# Altium schematic sheet AtlasControl-A1.01.01F.SchDoc: ATLAS-CONTROL-A1
size A3; Revision: 01; SheetNumber: 2; SheetTotal: 7
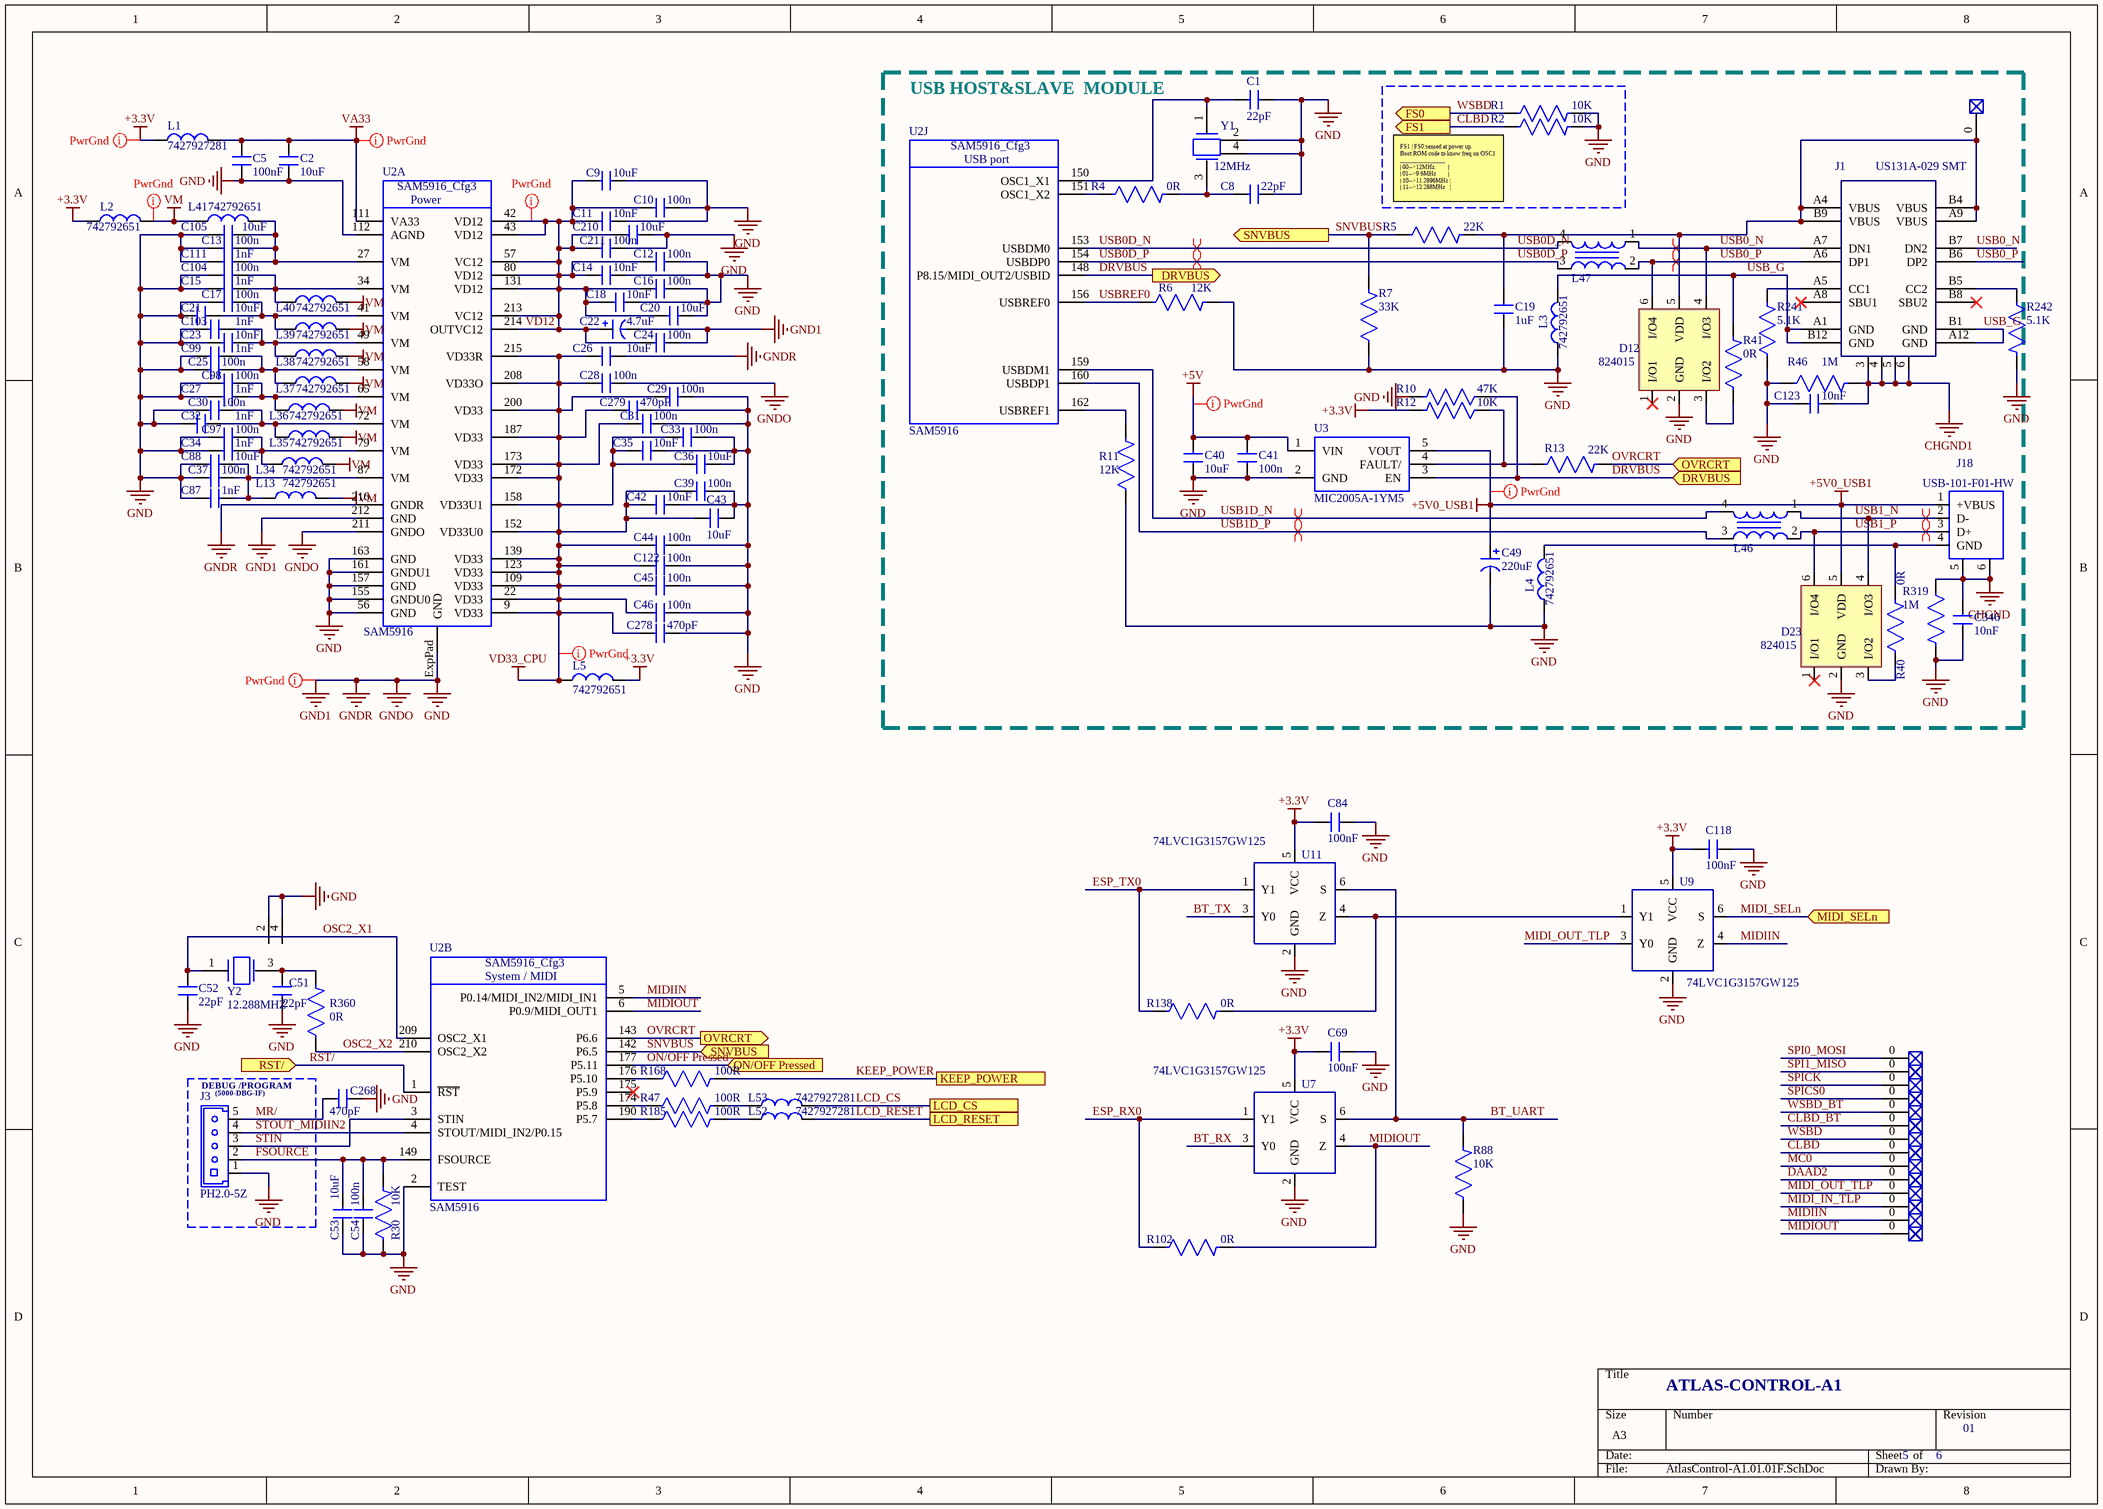
[diagram p0: AtlasControl-A1.01.01F.SchDoc]

## Parts
+5V2  CON/TestPoints  [TP]  (value not drawn)  (no BOM)
C1  22pF  [0402]
C2  10uF  [0402]
C5  100nF  [0402]
C8  22pF  [0402]
C9  10uF  [0603]
C10  100n  [0603]
C11  10nF  [0603]
C12  100n  [0603]
C13  100n  [0603]
C14  10nF  [0603]
C15  1nF  [0603]
C16  100n  [0603]
C17  100n  [0603]
C18  10nF  [0603]
C19  1uF  [0603]
C20  10uF  [0603]
C21  10uF  [0603]
C22  4.7uF  [CAP_TAN_A_3216]
C23  10nF  [0603]
C24  100n  [0603]
C25  100n  [0603]
C26  10uF  [0603]
C27  1nF  [0603]
C28  100n  [0603]
C29  100n  [0603]
C30  100n  [0603]
C31  100n  [0603]
C32  1nF  [0603]
C33  100n  [0603]
C34  1nF  [0603]
C35  10nF  [0603]
C36  10uF  [0603]
C37  100n  [0603]
C39  100n  [0603]
C40  10uF  [0603]
C41  100n  [0603]
C42  10nF  [0603]
C43  10uF  [0603]
C44  100n  [0603]
C45  100n  [0603]
C46  100n  [0603]
C49  220uF  [VT-6.3*7.7]
C51  22pF  [0402]
C52  22pF  [0402]
C53  10uF  [0603]
C54  100n  [0603]
C69  100nF  [0402]
C84  100nF  [0402]
C87  1nF  [0603]
C88  10uF  [0603]
C97  100n  [0603]
C98  100n  [0603]
C99  1nF  [0603]
C103  1nF  [0603]
C104  100n  [0603]
C105  10uF  [0603]
C111  1nF  [0603]
C118  100nF  [0402]
C122  100n  [0603]
C123  10nF  [0603]
C210  10uF  [0603]
C211  100n  [0603]
C268  470pF  [0603]
C278  470pF  [0603]
C279  470pF  [0603]
C346  10nF  [0603]
CKOUT  CON/TestPoints/DIP  [TP2]  (value not drawn)  (no BOM)
CLBD  CON/TestPoints/DIP  [TP2]  (value not drawn)  (no BOM)
CLBD_BT  CON/TestPoints/DIP  [TP2]  (value not drawn)  (no BOM)
D12  824015  [SOT23-6L]
D23  824015  [SOT23-6L]
DAAD2  CON/TestPoints/DIP  [TP2]  (value not drawn)  (no BOM)
J1  US131A-029 SMT  [US131A-029 SMT]
J3  value PH2.0-5Z  [PH2.0-05Z]  (hidden comment: CON/PH2.0/PH2.0-05Z)
J18  USB-101-F01-HW  [USBZ_UP_DW]
L1  7427927281  [0402]
L2  742792651  [0603]
L3  742792651  [0603]
L4  742792651  [0603]
L5  742792651  [0603]
L13  742792651  [0603]
L34  742792651  [0603]
L35  742792651  [0603]
L36  742792651  [0603]
L37  742792651  [0603]
L38  742792651  [0603]
L39  742792651  [0603]
L40  742792651  [0603]
L41  742792651  [0603]
L46  MCZ1210AH900L2TA0G  [MCZ1210]  (value not drawn)
L47  MCZ1210AH900L2TA0G  [MCZ1210]  (value not drawn)
L52  7427927281  [0402]
L53  7427927281  [0402]
MIDI_IN_TLP  CON/TestPoints/DIP  [TP2]  (value not drawn)  (no BOM)
MIDI_OUT_TLP  CON/TestPoints/DIP  [TP2]  (value not drawn)  (no BOM)
MIDIIN  CON/TestPoints/DIP  [TP2]  (value not drawn)  (no BOM)
MIDIOUT  CON/TestPoints/DIP  [TP2]  (value not drawn)  (no BOM)
R1  10K  [0402]
R2  10K  [0402]
R4  0R  [0402]
R5  22K  [0603]
R6  12K  [0402]
R7  33K  [0603]
R10  47K  [0603]
R11  12K  [0402]
R12  10K  [0402]
R13  22K  [0402]
R30  10K  [0603]
R40  0R  [0603]
R41  0R  [0603]
R46  1M  [0603]
R47  100R  [0402]
R88  10K  [0402]
R102  0R  [0402]
R138  0R  [0402]
R168  100R  [0402]
R185  100R  [0402]
R241  5.1K  [0402]
R242  5.1K  [0402]
R319  1M  [0603]
R360  0R  [0402]
SPI0_MOSI  CON/TestPoints/DIP  [TP2]  (value not drawn)  (no BOM)
SPI1_MISO  CON/TestPoints/DIP  [TP2]  (value not drawn)  (no BOM)
SPICK  CON/TestPoints/DIP  [TP2]  (value not drawn)  (no BOM)
SPICS0  CON/TestPoints/DIP  [TP2]  (value not drawn)  (no BOM)
U2  SAM5916  [LQFP216-26X26]  (parts A,B,J of 10)
U3  MIC2005A-1YM5  [SOT-23-5]
U7  74LVC1G3157GW125  [SOT363]
U9  74LVC1G3157GW125  [SOT363]
U11  74LVC1G3157GW125  [SOT363]
WSBD  CON/TestPoints/DIP  [TP2]  (value not drawn)  (no BOM)
WSBD_BT  CON/TestPoints/DIP  [TP2]  (value not drawn)  (no BOM)
Y1  12MHz  [Seam 3.2*2.5 4PAD-SMD]
Y2  12.288MHZ  [Seam 3.2*2.5 4PAD-SMD]

## Blocks framed on the sheet
USB HOST&SLAVE  MODULE: +5V2 C1 C8 C19 C40 C41 C49 C123 C346 D12 D23 J1 J18 L3 L4 L46 L47 R1 R2 R4-R7 R10-R13 R40 R41 R46 R241 R242 R319 U2 U3 Y1
DEBUG /PROGRAM: J3

## Ports
DRVBUS (in), DRVBUS (out), FS0 (out), FS1 (out), KEEP_POWER, LCD_CS, LCD_RESET, MIDI_SELn (in), ON/OFF Pressed (in), OVRCRT (in), OVRCRT (out), RST/ (in), SNVBUS (in), SNVBUS (out)

## Nets
+3.3V: C69.2 C84.2 C118.2 L1.1 L2.1 L5.2 R12.2 U7.5(VCC) U9.5(VCC) U11.5(VCC)
+5V: C40.1 C41.2 U3.1(VIN)
+5V0_USB1: C49.1 D23.5(VDD) J18.1(+VBUS) U3.5(VOUT)
CHGND: C346.2 J18.5 J18.6 R319.1
CHGND1: C123.1 J1.3 J1.4 J1.5 J1.6 R46.2
GND: C1.2 C2.2 C5.2 C8.2 C9.2 C10.2 C11.2 C12.2 C13.1 C14.2 C15.1 C16.2 C17.1 C18.2 C19.2 C20.2 C21.2 C22.2 C23.1 C24.2 C25.1 C26.2 C27.1 C28.2 C29.2 C30.1 C31.2 C32.2 C33.2 C34.1 C35.2 C36.2 C37.1 C39.2 C40.2 C41.1 C42.2 C43.2 C44.2 C45.2 C46.2 C49.2 C51.2 C52.2 C53.2 C54.1 C69.1 C84.1 C87.1 C88.2 C97.1 C98.1 C99.1 C103.1 C104.1 C105.1 C111.1 C118.1 C122.2 C123.2 C210.2 C211.2 C268.2 C278.2 C279.2 C346.1 D12.2(GND) D23.2(GND) J3.1 L3.1 L4.1 R1.2 R2.2 R6.2 R7.1 R10.2 R11.1 R30.1 R46.1 R88.1 R241.1 R242.2 R319.2 U2.2(TEST) U2.56(GND) U2.112(AGND) U2.155(GNDU0) U2.157(GND) U2.161(GNDU1) U2.163(GND) U2.211(GNDO) U2.212(GND) U2.216(GNDR) U2.ExpPad(GND) U3.2(GND) U7.2(GND) U9.2(GND) U11.2(GND) Y1.2 Y1.4 Y2.2 Y2.4  [also labelled GND1, GNDO, GNDR]
VA33: C2.1 C5.1 L1.2 U2.111(VA33)
VD33_CPU: C26.1 C28.1 C29.1 C31.1 C33.1 C35.1 C36.1 C39.1 C42.1 C43.1 C44.1 C45.1 C46.1 C122.1 C278.1 C279.1 L5.1 U2.9(VD33) U2.22(VD33) U2.109(VD33) U2.123(VD33) U2.139(VD33) U2.152(VD33U0) U2.158(VD33U1) U2.172(VD33) U2.173(VD33) U2.187(VD33) U2.200(VD33) U2.208(VD33O) U2.215(VD33R)
VM: L2.2 L13.2 L34.2 L35.2 L36.2 L37.2 L38.2 L39.2 L40.2 L41.1
BT_RX: U7.3(Y0)
BT_TX: U11.3(Y0)
BT_UART: R88.2 U7.6(S) U11.6(S)
CLBD: CLBD.0 R2.1 ; port FS1
CLBD_BT: CLBD_BT.0
DAAD2: DAAD2.0
DRVBUS: R10.1 U2.148(P8.15/MIDI_OUT2/USBID) U3.3(EN) ; port DRVBUS
ESP_RX0: R102.1 U7.1(Y1)
ESP_TX0: R138.1 U11.1(Y1)
FSOURCE: C53.1 C54.2 J3.2 R30.2 U2.149(FSOURCE)
KEEP_POWER: R168.2 ; port KEEP_POWER
LCD_CS: L53.2 ; port LCD_CS
LCD_RESET: L52.2 ; port LCD_RESET
MC0: CKOUT.0
MIDI_IN_TLP: MIDI_IN_TLP.0
MIDI_OUT_TLP: MIDI_OUT_TLP.0 U9.3(Y0)
MIDI_SELn: U9.6(S) ; port MIDI_SELn
MIDIIN: MIDIIN.0 U2.5(P0.14/MIDI_IN2/MIDI_IN1) U9.4(Z)
MIDIOUT: MIDIOUT.0 R102.2 U2.6(P0.9/MIDI_OUT1) U7.4(Z)
MR/: C268.1 J3.5
ON/OFF Pressed: U2.177(P5.11) ; port ON/OFF Pressed
OSC2_X1: C52.1 U2.209(OSC2_X1) Y2.1
OSC2_X2: R360.1 U2.210(OSC2_X2)
OVRCRT: R13.2 U2.143(P6.6) ; port OVRCRT
RST/: U2.1(~{RST}) ; port RST/
SNVBUS: R5.1 R7.2 U2.142(P6.5) ; port SNVBUS
SPI0_MOSI: SPI0_MOSI.0
SPI1_MISO: SPI1_MISO.0
SPICK: SPICK.0
SPICS0: SPICS0.0
STIN: J3.3 U2.3(STIN)
STOUT_MIDIIN2: J3.4 U2.4(STOUT/MIDI_IN2/P0.15)
USB0_N: D12.4(I/O3) J1.A7(DN1) J1.B7(DN2) L47.1
USB0_P: D12.6(I/O4) J1.A6(DP1) J1.B6(DP2) L47.2
USB0D_N: L47.4 U2.153(USBDM0)
USB0D_P: L47.3 U2.154(USBDP0)
USB1_N: D23.4(I/O3) J18.2(D-) L46.1
USB1_P: D23.6(I/O4) J18.3(D+) L46.2
USB1D_N: L46.4 U2.159(USBDM1)
USB1D_P: L46.3 U2.160(USBDP1)
USB_G: J1.A1(GND) J1.A12(GND) J1.B1(GND) J1.B12(GND) L3.2 R41.2
USBREF0: R6.1 U2.156(USBREF0)
VD12: C9.1 C10.1 C11.1 C12.1 C14.1 C16.1 C18.1 C20.1 C22.1 C24.1 C210.1 C211.1 U2.42(VD12) U2.43(VD12) U2.57(VC12) U2.80(VD12) U2.131(VD12) U2.213(VC12) U2.214(OUTVC12)
WSBD: R1.1 WSBD.0 ; port FS0
WSBD_BT: WSBD_BT.0
Net+5V2_0: +5V2.0 C19.1 D12.5(VDD) J1.A4(VBUS) J1.A9(VBUS) J1.B4(VBUS) J1.B9(VBUS) R5.2
NetC1_1: C1.1 U2.150(OSC1_X1) Y1.1
NetC8_1: C8.1 R4.2 Y1.3
NetC13_2: C13.2 C105.2 C111.2 L41.2 U2.27(VM)
NetC15_2: C15.2 C104.2 L40.1 U2.34(VM)
NetC17_2: C17.2 C21.1 L39.1 U2.41(VM)
NetC23_2: C23.2 C103.2 L38.1 U2.49(VM)
NetC25_2: C25.2 C99.2 L37.1 U2.58(VM)
NetC27_2: C27.2 C98.2 L36.1 U2.65(VM)
NetC30_2: C30.2 C32.1 L35.1 U2.72(VM)
NetC34_2: C34.2 C97.2 L34.1 U2.79(VM)
NetC37_2: C37.2 C87.2 C88.1 L13.1 U2.87(VM)
NetC51_1: C51.1 R360.2 Y2.3
NetD12_3: D12.3(I/O2) R41.1
NetD23_3: D23.3(I/O2) R40.1
NetJ1_A5: J1.A5(CC1) R241.2
NetJ1_B5: J1.B5(CC2) R242.1
NetJ18_4: J18.4(GND) L4.2 R40.2
NetL52_1: L52.1 R185.2
NetL53_1: L53.1 R47.2
NetR4_1: R4.1 U2.151(OSC1_X2)
NetR11_2: R11.2 U2.162(USBREF1)
NetR12_1: R12.1 R13.1 U3.4(FAULT/)
NetR47_1: R47.1 U2.174(P5.8)
NetR138_2: R138.2 U9.1(Y1) U11.4(Z)
NetR168_1: R168.1 U2.176(P5.10)
NetR185_1: R185.1 U2.190(P5.7)

Not connected (* = marked no-connect by the designer): D12 1(I/O1)*; D23 1(I/O1)*; J1 A8(SBU1)* B8(SBU2)*; U2 175(P5.9)*

## Layout directives
net class PwrGnd: +3.3V, +5V, +5V0_USB1, GND, VA33, VD12, VD33_CPU, VM
differential pair: USB0_N, USB0_P, USB0D_N, USB0D_P, USB1_N, USB1_P, USB1D_N, USB1D_P

## Notes on the sheet
- FS1 | FS0:sensed at power up.
  Boot ROM code to know freq on OSC1
  _______________
  | 00-->12MHz         |
  | 01-->9.6MHz        |
  | 10-->11.2896MHz |
  | 11-->12.288MHz   |
- (near J3) (5000-DBG-IF)
- 5
- 6
- (in symbol IC/CPU/SAM5916_CFG3/LQFP216, part A) SAM5916_Cfg3; Power
- (in symbol IC/CPU/SAM5916_CFG3/LQFP216, part B) SAM5916_Cfg3; System / MIDI
- (in symbol IC/CPU/SAM5916_CFG3/LQFP216, part J) SAM5916_Cfg3; USB port

## Library data of the parts
C1 C8 C51 C52 = CAP/CE/0402/50V/22PF/5%/COG: 贴片电容22P(ROHS); MANUFACTURER: 上海博奥电子有限公司; PART NUMBER: A1583; MODEL: C0402-22P-50V-5%-COG; Tolerance: 5%; Voltage Rating: 50V; PKG TYPE: 0402; VALUE: 22pF
C2 = CAP/CE/0402/10V/10uF/20%: 贴片电容10u(ROHS); MANUFACTURER: 上海博奥电子有限公司; PART NUMBER: B1522; MODEL: C0402-10u-10V-20%-X5R; Tolerance: 20%; Voltage Rating: 10V; *CRLF**: cost"; VALUE: 10uF; PKG TYPE: 0402
C5 C69 C84 C118 = CAP/CE/0402/16V/100NF/5%: 贴片电容100n(ROHS); MANUFACTURER: 上海博奥电子有限公司; PART NUMBER: A1504; *CRLF**: cost"; MODEL: C0402-100nF-16V-5％; Tolerance: 5%; Voltage Rating: 16V; PKG TYPE: 0402; VALUE: 100nF
C9 C20 C21 C26 C36 C40 C43 C53 C88 C105 C210 = CAP/CE/0603/16V/10UF/10%: 贴片电容10u(ROHS); MANUFACTURER: 上海博奥电子有限公司; PART NUMBER: B1500; MODEL: C0603-10u-16V-10％; Tolerance: 10%; Voltage Rating: 16V; VALUE: 10uF; PKG TYPE: 0603
C10 C12 C13 C16 C17 C24 C25 C28-C31 C33 C37 C39 C41 C44-C46 C54 C97 C98 C122 C211 = CAP/CE/0603/50V/100NF/10%: 贴片电容100n(ROHS); MANUFACTURER: 上海博奥电子有限公司; PART NUMBER: A1578; *CRLF**: cost"; MODEL: CL10B104KB8NNNC; Tolerance: 10%; Voltage Rating: 50V; PKG TYPE: 0603; VALUE: 100n
C11 C14 C18 C23 C35 C42 C123 C346 = CAP/CE/0603/50V/10NF/5%: 贴片电容10n(ROHS); MANUFACTURER: 上海博奥电子有限公司; PART NUMBER: 1539; MODEL: C0603-10n-50V-5％; Tolerance: 5%; Voltage Rating: 25V; Cost: *; Manufacturer #2: *; PKG TYPE: 0603; VALUE: 10nF
C15 C27 C34 C99 C103 C111 = CAP/CE/0603/50V/1NF/5%: 贴片电容1n(ROHS); MANUFACTURER: 上海博奥电子有限公司; PART NUMBER: 1560; MODEL: C0603-1n-50V-5％; Tolerance: 10%; Voltage Rating: 50V; *CRLF**: cost"; Manufacturer #2: *; PKG TYPE: 0603; VALUE: 1nF
C19 = CAP/CE/0603/25V/1UF/10%: 贴片电容1u(ROHS); MANUFACTURER: 上海博奥电子有限公司; PART NUMBER: 1548; MODEL: C0603-1u-25V-10％; Tolerance: 10%; Voltage Rating: 25V; Manufacturer #2: *; VALUE: 1uF; Cost: *; PKG TYPE: 0603; ComponentLink1Description: datashee; ComponentLink1URL: ThisWorkbook.Path & "\MAX3232.PDF"
C22 = CAP/TANT-A/16V/4.7UF/10%: 钽电容 A型(ROHS); MANUFACTURER: 上海博奥电子有限公司; PART NUMBER: 1524; *CRLF**: cost"; MODEL: Tant-A-4.7u-16V-10%; Manufacturer #2: F930J106KAA; PKG: SMD 3216; VALUE: 4.7uF
C32 = CAP/CE/0603/50V/1NF/10%: 贴片电容1n(ROHS); MANUFACTURER: 上海博奥电子有限公司; PART NUMBER: 1543; MODEL: C0603-1n-50V-10％; Tolerance: 10%; Voltage Rating: 50V; *CRLF**: cost"; VALUE: 1nF; PKG TYPE: 0603; Manufacturer #2: *
C49 = CAP/VE-16V-220uF-8x10MM±20%: VE型片式电解电容220uF(ROHS); PART NUMBER: 640; *CRLF**: cost"; PKG: 8x10; MODEL: VE-16V-220uF-8x10MM±20%; VALUE: 220uF
C87 = CAP/CE/0603/50V/1NF/5%: 贴片电容1n(ROHS); MANUFACTURER: 上海博奥电子有限公司; PART NUMBER: 1560; *CRLF**: cost"; MODEL: C0603-1n-50V-5％; Tolerance: 10%; Voltage Rating: 50V; Manufacturer #2: *; PKG TYPE: 0603; VALUE: 1nF
C104 = CAP/CE/0603/50V/100NF/10%: MULTILAYER CERAMIC CAPACITORS多层陶瓷电容器; MANUFACTURER: 上海博奥电子有限公司; PART NUMBER: A1578; MODEL: CL10B104KB8NNNC; Tolerance: 10%; Voltage Rating: 50V; *CRLF**: cost"; PKG TYPE: 0603; VALUE: 100n
C268 C278 C279 = CAP/CE/0603/50V/470PF/5%: 贴片电容470p(ROHS); MANUFACTURER: 上海博奥电子有限公司; PART NUMBER: 1566; *CRLF**: cost"; MODEL: C0603-470p-50V-5％; Tolerance: 5%; Voltage Rating: 50V; Manufacturer #2: *; PKG TYPE: 0603; VALUE: 470pF
CKOUT CLBD CLBD_BT DAAD2 MIDI_IN_TLP MIDI_OUT_TLP MIDIIN MIDIOUT SPI0_MOSI SPI1_MISO SPICK SPICS0 WSBD WSBD_BT = CON/TestPoints/DIP: TEST; Cost: *
D12 D23 = PROTECTION/TVS/824015/SOT23-6L: TVS Diode; PART NUMBER: 1803; MODEL: 824015; PKG TYPE: SOT23-6L; VALUE: 824015
J1 = CON/USB 3.0/C/SMT/US131A-029 SMT: USB TYPE C母座短体外壳; MANUFACTURER: 杭州佳路克电子有限公司; PART NUMBER: A13394; *CRLF**: Cost"; PKG TYPE: FEMALE RA PCB-MOUNT TYPE "A"; MODEL: US131A-029 SMT; VALUE: US131A-029 SMT
J3 = CON/PH2.0/PH2.0-05Z: 插座5Z; MANUFACTURER: 常州市帆航电子有限公司; PART NUMBER: 13409; *CRLF**: Cost"; Manufacturer #2: *; MODEL: PH2.0-5Z
J18 = CON/USB-101-F01-HW/USB/A/W: 上行USB插口; MANUFACTURER: 东莞市精进五金塑胶有限公司; PART NUMBER: 13424; *CRLF**: Cost"; PKG TYPE: FEMALE RA PCB-MOUNT TYPE "B"; MODEL: USB-101-F01-HW; VALUE: USB-101-F01-HW
L1 L52 L53 = IND/7427927281/0402: 贴片磁珠; MANUFACTURER: 伍尔特(天津)电子有限公司; PART NUMBER: 13786; *CRLF**: Cost"; Manufacturer #2: *; MODEL: 7427927281; PKG TYPE: 0402; VALUE: 7427927281
L2-L5 L13 L34-L41 = IND/742792651/0603: 贴片磁珠; MANUFACTURER: 伍尔特(天津)电子有限公司; PART NUMBER: 13658; *CRLF**: Cost"; Manufacturer #2: *; MODEL: 742792651; PKG TYPE: 0603; VALUE: 742792651
L46 L47 = IND/MCZ1210AH900L2TA0G/MCZ1210: 贴片共模电感; MANUFACTURER: 伍尔特（天津）电子有限公司; PART NUMBER: 13731; MODEL: MCZ1210AH900L2TA0G; VALUE: MCZ1210AH900L2TA0G
R1 R2 R12 R88 = RES/CE/0402/10K/1%: 贴片电阻10K; MANUFACTURER: 上海博奥电子有限公司; PART NUMBER: A308; *CRLF**: cost"; MODEL: R0402-10K-1/16W-1%; PKG TYPE: 0402; VALUE: 10K
R4 R102 R138 R360 = RES/CE/0402/0R/1%: 贴片电阻0R; MANUFACTURER: 深圳市万联芯科技有限公司; PART NUMBER: A317; MODEL: R0402-0R-1/16W-1%; PKG TYPE: 0402; VALUE: 0R
R5 = RES/CE/0603/22K/1%: 贴片电阻22K(ROHS); MANUFACTURER: 上海博奥电子有限公司; Part Number: A203; Verify: No; Model: R0603-22K-1/10W-1％; Value: 22K
R6 R11 = RES/CE/0402/12K/1%: 贴片电阻12K(ROHS); MANUFACTURER: 深圳市万联芯科技有限公司; PART NUMBER: D167; *CRLF**: cost"; MODEL: R0402-12K-1/16W-1%; PKG TYPE: 0402; VALUE: 12K
R7 = RES/CE/0603/33K/1%: 贴片电阻33K(ROHS); MANUFACTURER: 上海博奥电子有限公司; PART NUMBER: A364; MODEL: R0603-33K-1/10W-1%; PKG TYPE: 0603; VALUE: 33K
R10 = RES/CE/0603/47K/5%: 贴片电阻47K(ROHS); MANUFACTURER: 上海博奥电子有限公司; PART NUMBER: 339; *CRLF**: cost"; MODEL: R0603-47K-1/10W-5％; PKG TYPE: 0603; VALUE: 47K
R13 = RES/CE/0402/22K/1%: 贴片电阻22K(ROHS); MANUFACTURER: 深圳市万联芯科技有限公司; PART NUMBER: B335; MODEL: R0402-22K-1/16W-1%; *CRLF**: cost"; VALUE: 22K; PKG TYPE: 0402
R30 = RES/CE/0603/10K/1%: 贴片电阻10K(ROHS); MANUFACTURER: 上海博奥电子有限公司; PART NUMBER: 353; *CRLF**: cost"; MODEL: R0603-10K-1/10W-1％; PKG TYPE: 0603; VALUE: 10K
R40 R41 = RES/CE/0603/0R/1%: 贴片电阻0R; MANUFACTURER: 上海博奥电子有限公司; PART NUMBER: A271; *CRLF**: cost"; MODEL: R0603-0R-1/10W-1%; PKG TYPE: 0603; VALUE: 0R
R46 R319 = RES/CE/0603/1M/1%: 贴片电阻1M(ROHS); MANUFACTURER: 上海博奥电子有限公司; PART NUMBER: A148; *CRLF**: cost"; MODEL: R0603-1M-1/10W-1％; PKG TYPE: 0603; VALUE: 1M
R47 R168 R185 = RES/CE/0402/100R/1%: 贴片电阻100R; MANUFACTURER: 上海博奥电子有限公司; PART NUMBER: A313; *CRLF**: cost"; MODEL: R0402-100R-1/16W-1%; PKG TYPE: 0402; VALUE: 100R
R241 R242 = RES/CE/0402/5.1K/1%: 贴片电阻5.1k(ROHS); MANUFACTURER: 上海博奥电子有限公司; PART NUMBER: B293; *CRLF**: cost"; MODEL: R0402-5.1K-1/16W-1%; PKG TYPE: 0402; VALUE: 5.1K
U2 = IC/CPU/SAM5916_CFG3/LQFP216: 音源芯片; Part Number: 3136; Model: SAM5916B/LQFP216; PCB DECAL: LQFP216; Value: SAM5916; ClassName: SAM_Bypass
U3 = IC/PWR/MIC2005A-1YM5/SOT-23-5: 限流电路(500mA); PART NUMBER: 7707; Value: MIC2005A-1YM5; MODEL: MIC2005A-1YM5/SOT-23-5
U7 U9 U11 = IC/multiplexer/74LVC1G3157GW125/SOT363: 复用器; PART NUMBER: 2964; MANUFACTURER: NXP Semiconductors; MODEL: 74LVC1G3157GW125/SOT363; PKG TYPE: SOT363; VALUE: 74LVC1G3157GW125
Y1 = XTL/12MHZ/KX12.00MBF2T-H3/SMD3225: 贴片晶振12MHz; MANUFACTURER: 张家港志丰科技有限公司; PART NUMBER: 2262; *CRLF**: Cost"; MODEL: KX12.00MBF2T-H3/SMD3225; PKG TYPE: *; VALUE: 12MHz
Y2 = XTL/KX12.288MBF2T-H5/SMD: 贴片晶振12.288MHz; MANUFACTURER: 张家港志丰科技有限公司; PART NUMBER: 2271; MODEL: KX12.288MBF2T-H5/SMD3225; VALUE: 12.288MHZ
+5V2 = CON/TestPoints: Cost: *